# Altium schematic sheet PWR_MNG_V1.0.SchDoc
size A3
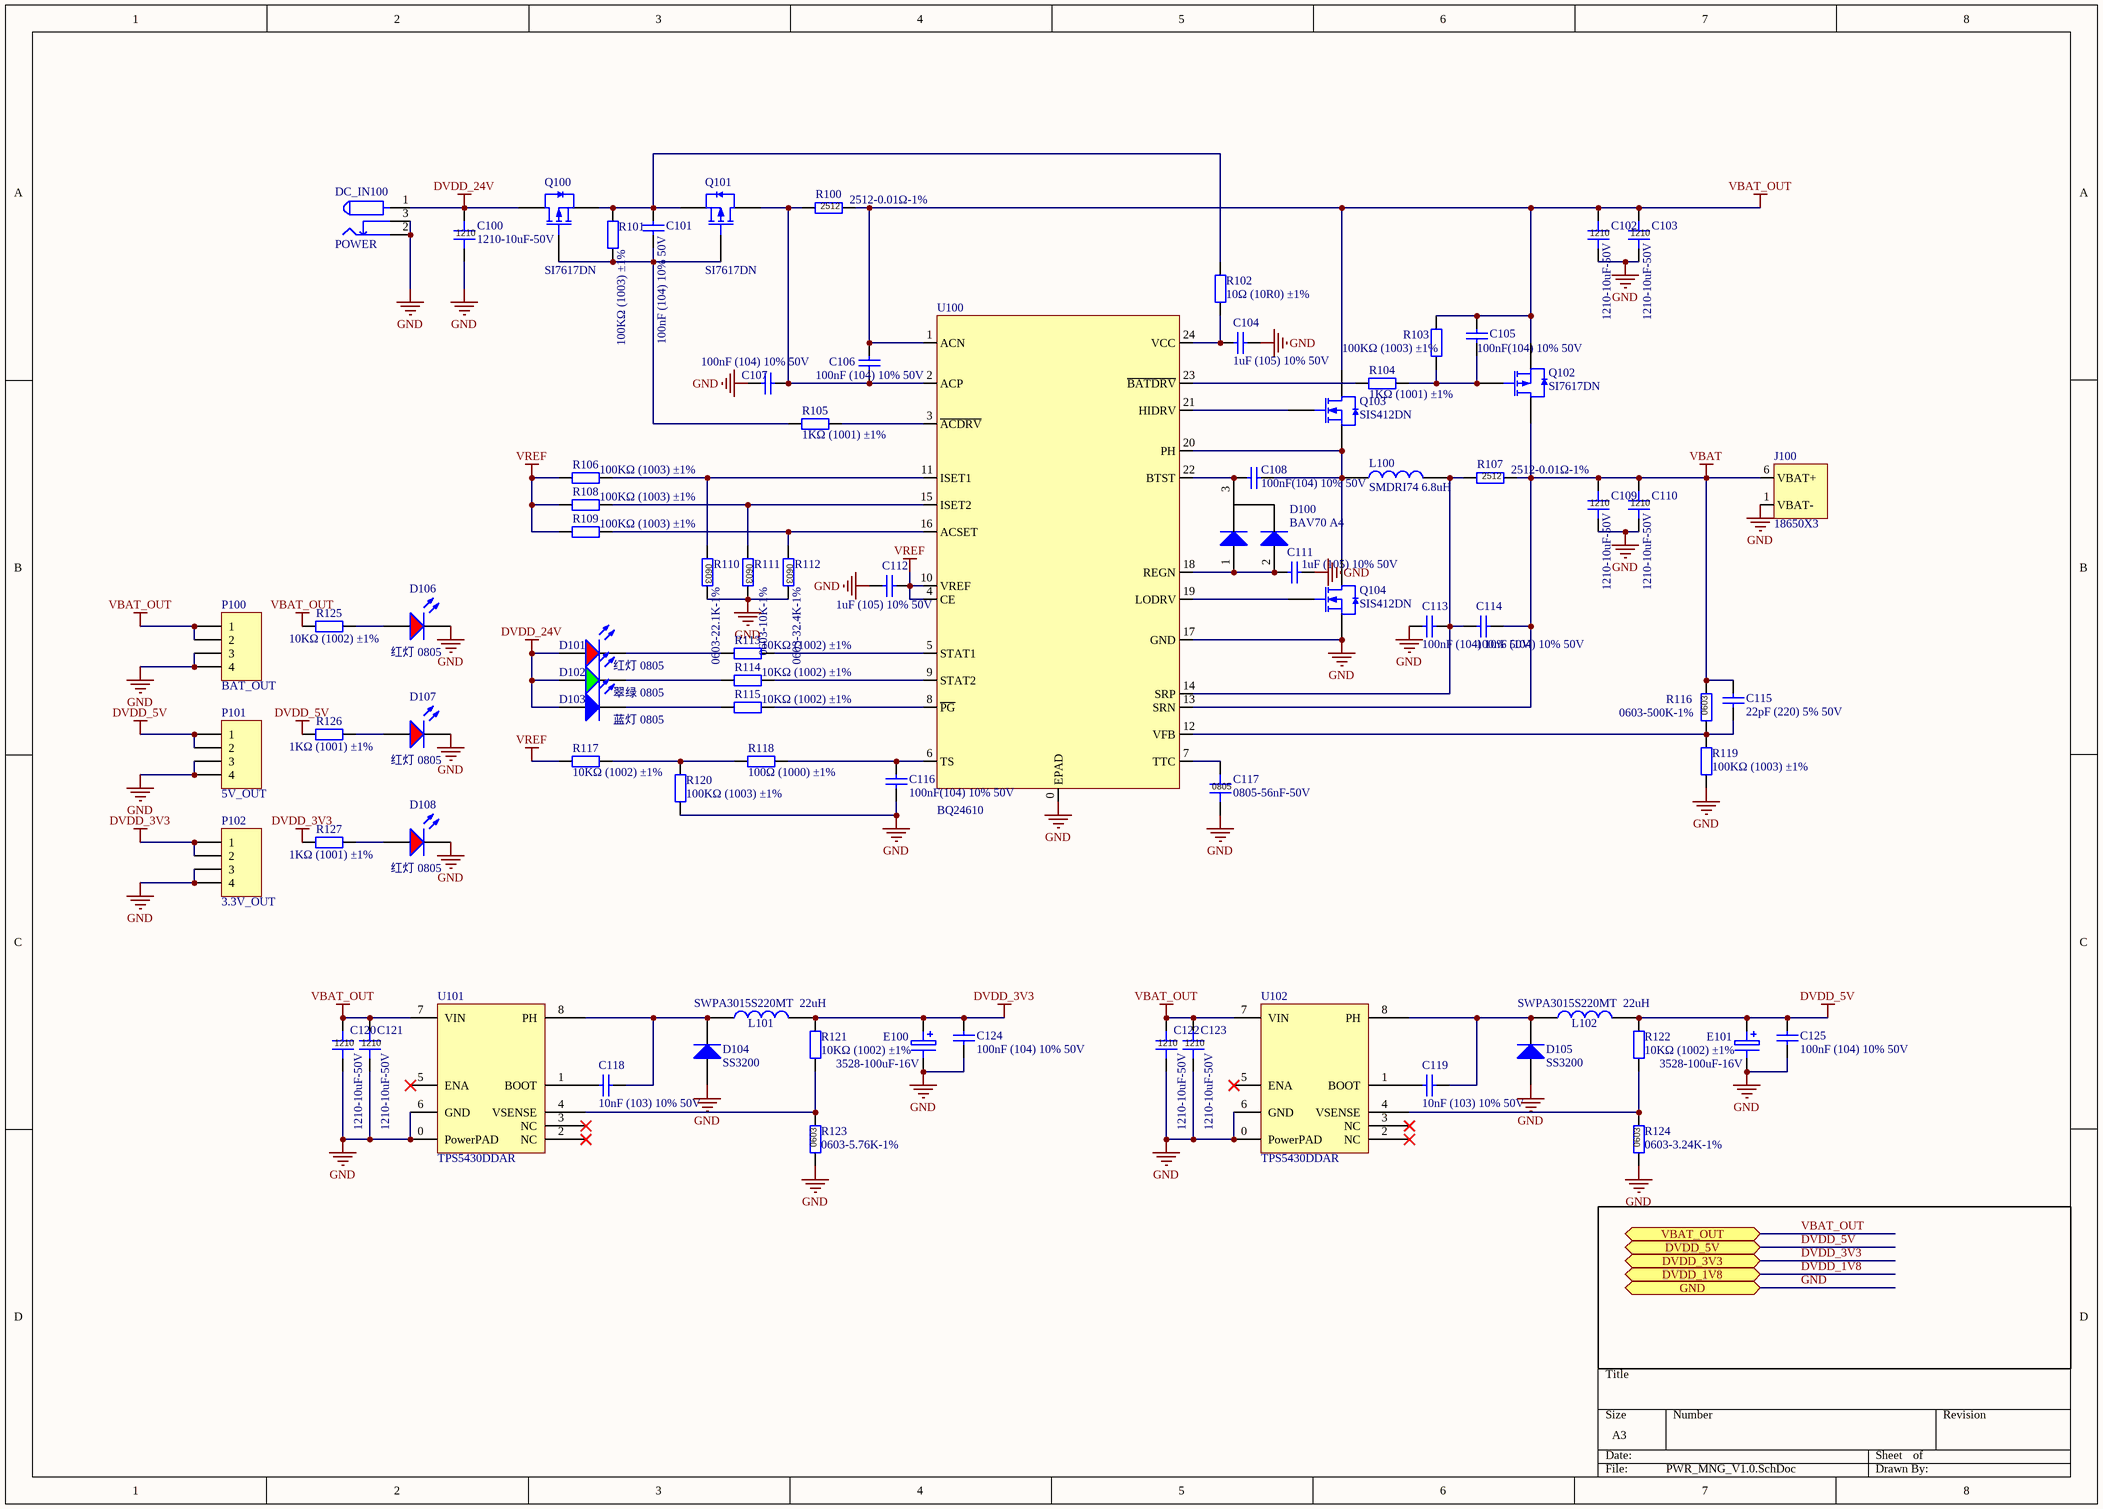
[diagram p0: PWR_MNG_V1.0.SchDoc]

## Parts
C100  1210-10uF-50V  [1210_C]
C101  100nF (104) 10% 50V  [0603_C]
C102  1210-10uF-50V  [1210_C]
C103  1210-10uF-50V  [1210_C]
C104  1uF (105) 10% 50V  [0805_C]
C105  100nF(104) 10% 50V  [0805_C]
C106  100nF (104) 10% 50V  [0603_C]
C107  100nF (104) 10% 50V  [0603_C]
C108  100nF(104) 10% 50V  [0805_C]
C109  1210-10uF-50V  [1210_C]
C110  1210-10uF-50V  [1210_C]
C111  1uF (105) 10% 50V  [0805_C]
C112  1uF (105) 10% 50V  [0805_C]
C113  100nF (104) 10% 50V  [0603_C]
C114  100nF (104) 10% 50V  [0603_C]
C115  22pF (220) 5% 50V  [0603_C]
C116  100nF(104) 10% 50V  [0805_C]
C117  0805-56nF-50V  [0805_C]
C118  10nF (103) 10% 50V  [0603_C]
C119  10nF (103) 10% 50V  [0603_C]
C120  1210-10uF-50V  [1210_C]
C121  1210-10uF-50V  [1210_C]
C122  1210-10uF-50V  [1210_C]
C123  1210-10uF-50V  [1210_C]
C124  100nF (104) 10% 50V  [0603_C]
C125  100nF (104) 10% 50V  [0603_C]
D100  BAV70 A4  [SOT-23(SOT-23-3)]
D101  红灯 0805  [0805_LED_S1]
D102  翠绿 0805  [0805_LED_S1]
D103  蓝灯 0805  [0805_LED_S1]
D104  SS3200  [SMA(DO-214AC)_S1]
D105  SS3200  [SMA(DO-214AC)_S1]
D106  红灯 0805  [0805_LED_S1]
D107  红灯 0805  [0805_LED_S1]
D108  红灯 0805  [0805_LED_S1]
DC_IN100  POWER  [DC002]
E100  3528-100uF-16V  [ES_3528]
E101  3528-100uF-16V  [ES_3528]
J100  18650X3  [18650X3]
L100  SMDRI74 6.8uH  [L 7.5*7.5*4.5]
L101  SWPA3015S220MT  22uH  [L 3.0*3.0*1.5]
L102  SWPA3015S220MT  22uH  [L 3.0*3.0*1.5]
P100  BAT_OUT  [HDR1X4]
P101  5V_OUT  [HDR1X4]
P102  3.3V_OUT  [HDR1X4]
Q100  SI7617DN  [PAK-1212-8]
Q101  SI7617DN  [PAK-1212-8]
Q102  SI7617DN  [PAK-1212-8]
Q103  SIS412DN  [PAK-1212-8]
Q104  SIS412DN  [PAK-1212-8]
R100  2512-0.01Ω-1%  [2512_R]
R101  100KΩ (1003) ±1%  [0603_R]
R102  10Ω (10R0) ±1%  [0805_R]
R103  100KΩ (1003) ±1%  [0805_R]
R104  1KΩ (1001) ±1%  [0805_R]
R105  1KΩ (1001) ±1%  [0603_R]
R106  100KΩ (1003) ±1%  [0603_R]
R107  2512-0.01Ω-1%  [2512_R]
R108  100KΩ (1003) ±1%  [0603_R]
R109  100KΩ (1003) ±1%  [0603_R]
R110  0603-22.1K-1%  [0603_R]
R111  0603-10K-1%  [0603_R]
R112  0603-32.4K-1%  [0603_R]
R113  10KΩ (1002) ±1%  [0805_R]
R114  10KΩ (1002) ±1%  [0805_R]
R115  10KΩ (1002) ±1%  [0805_R]
R116  0603-500K-1%  [0603_R]
R117  10KΩ (1002) ±1%  [0805_R]
R118  100Ω (1000) ±1%  [0805_R]
R119  100KΩ (1003) ±1%  [0603_R]
R120  100KΩ (1003) ±1%  [0805_R]
R121  10KΩ (1002) ±1%  [0603_R]
R122  10KΩ (1002) ±1%  [0603_R]
R123  0603-5.76K-1%  [0603_R]
R124  0603-3.24K-1%  [0603_R]
R125  10KΩ (1002) ±1%  [0805_R]
R126  1KΩ (1001) ±1%  [0805_R]
R127  1KΩ (1001) ±1%  [0805_R]
U100  BQ24610  [QFN-24_4x4x05P]
U101  TPS5430DDAR  [SOP-8_150mil DCDC]
U102  TPS5430DDAR  [SOP-8_150mil DCDC]

## Ports
DVDD_1V8, DVDD_3V3, DVDD_5V, GND, VBAT_OUT

## Nets
DVDD_3V3: C124.2 E100.1 L101.2 P102.1 P102.2 R121.2 R127.1 ; port DVDD_3V3
DVDD_5V: C125.2 E101.1 L102.2 P101.1 P101.2 R122.2 R126.1 ; port DVDD_5V
DVDD_24V: C100.1 D101.A D102.A D103.A DC_IN100.1 Q100.3(D)
GND: C100.2 C102.2 C103.2 C104.2 C107.1 C109.2 C110.2 C111.1 C112.1 C113.1 C116.1 C117.2 C120.2 C121.2 C122.2 C123.2 C124.1 C125.1 D104.1(A) D105.1(A) D106.K D107.K D108.K DC_IN100.2 DC_IN100.3 E100.2(E) E101.2(E) J100.1(VBAT-) P100.3 P100.4 P101.3 P101.4 P102.3 P102.4 Q104.2(S) R110.2 R111.2 R112.2 R119.1 R120.1 R123.1 R124.1 U100.0(EPAD) U100.17(GND) U101.0(PowerPAD) U101.6(GND) U102.0(PowerPAD) U102.6(GND) ; port GND
VBAT: C109.1 C110.1 C114.2 C115.2 J100.6(VBAT+) Q102.3(D) R107.2 R116.2 U100.13(SRN)
VBAT_OUT: C102.1 C103.1 C105.2 C106.2 C120.1 C121.1 C122.1 C123.1 P100.1 P100.2 Q102.2(S) Q103.3(D) R100.2 R103.2 R125.1 U100.1(ACN) U101.7(VIN) U102.7(VIN) ; port VBAT_OUT
VREF: C112.2 R106.1 R108.1 R109.1 R117.1 U100.4(CE) U100.10(VREF)
DVDD_1V8: port DVDD_1V8
NetC101_1: C101.1 Q100.1(G) Q101.1(G) R101.1 R105.2
NetC101_2: C101.2 Q100.2(S) Q101.2(S) R101.2 R102.2
NetC104_1: C104.1 R102.1 U100.24(VCC)
NetC105_1: C105.1 Q102.1(G) R103.1 R104.2
NetC106_1: C106.1 C107.2 Q101.3(D) R100.1 U100.2(ACP)
NetC108_1: C108.1 D100.3(K) U100.22(BTST)
NetC108_2: C108.2 L100.1 Q103.2(S) Q104.3(D) U100.20(PH)
NetC111_2: C111.2 D100.1(A) D100.2(A) U100.18(REGN)
NetC113_2: C113.2 C114.1 L100.2 R107.1 U100.14(SRP)
NetC115_1: C115.1 R116.1 R119.2 U100.12(VFB)
NetC116_2: C116.2 R118.2 U100.6(TS)
NetC117_1: C117.1 U100.7(TTC)
NetC118_1: C118.1 U101.1(BOOT)
NetC118_2: C118.2 D104.2(K) L101.1 U101.8(PH)
NetC119_1: C119.1 U102.1(BOOT)
NetC119_2: C119.2 D105.2(K) L102.1 U102.8(PH)
NetD101_K: D101.K R113.1
NetD102_K: D102.K R114.1
NetD103_K: D103.K R115.1
NetD106_A: D106.A R125.2
NetD107_A: D107.A R126.2
NetD108_A: D108.A R127.2
NetQ103_1: Q103.1(G) U100.21(HIDRV)
NetQ104_1: Q104.1(G) U100.19(LODRV)
NetR104_1: R104.1 U100.23(~{BATDRV})
NetR105_1: R105.1 U100.3(~{ACDRV})
NetR106_2: R106.2 R110.1 U100.11(ISET1)
NetR108_2: R108.2 R111.1 U100.15(ISET2)
NetR109_2: R109.2 R112.1 U100.16(ACSET)
NetR113_2: R113.2 U100.5(STAT1)
NetR114_2: R114.2 U100.9(STAT2)
NetR115_2: R115.2 U100.8(~{PG})
NetR117_2: R117.2 R118.1 R120.2
NetR121_1: R121.1 R123.2 U101.4(VSENSE)
NetR122_1: R122.1 R124.2 U102.4(VSENSE)

Not connected (* = marked no-connect by the designer): U101 2(NC)* 3(NC)* 5(ENA)*; U102 2(NC)* 3(NC)* 5(ENA)*

## Notes on the sheet
- (in symbol 0603 10KΩ (103) 1%) 0603
- (in symbol 0805 100nF (104) 10% 50V) 0805
- (in symbol 1210 10uF (106) 10% 50V) 1210
- (in symbol 2512 10KΩ (103) 1%) 2512

## Library data of the parts
C100 C102 C103 C109 C110 C120-C123 = 1210 10uF (106) 10% 50V: 贴片电容
C101 C106 C107 C113 C114 C124 C125 = 0603 100nF (104) 10% 50V: 贴片电容; ComponentLink1Description: 供应商链接; ComponentLink1URL: http://www.szlcsc.com/product/details_15331.html; Package: 0603; Supplier: LC; SuppliersPartNumber: C14663
C104 C111 C112 = 0805 1uF (105) 10% 50V: 贴片电容; ComponentLink1Description: 供应商链接; ComponentLink1URL: http://www.szlcsc.com/product/details_29074.html; Package: 0805; Supplier: LC; SuppliersPartNumber: C28323
C105 C108 C116 = 0805 100nF(104) 10% 50V: 贴片电容; ComponentLink1Description: 供应商链接; ComponentLink1URL: http://www.szlcsc.com/product/details_50686.html; Package: 0805; Supplier: LC; SuppliersPartNumber: C49678
C115 = 0603 22pF (220) 5% 50V: 贴片电容; ComponentLink1Description: 供应商链接; ComponentLink1URL: http://www.szlcsc.com/product/details_2005.html; Package: 0603; Supplier: LC; SuppliersPartNumber: C1653
C117 = 0805 100nF (104) 10% 50V: 贴片电容
C118 C119 = 0603 10nF (103) 10% 50V: 贴片电容; ComponentLink1Description: 供应商链接; ComponentLink1URL: http://www.szlcsc.com/product/details_58143.html; Package: 0603; Supplier: LC; SuppliersPartNumber: C57112
D100 = SOT-23 BAV70 A4: 开关二极管; ComponentLink1Description: 供应商链接; ComponentLink1URL: http://www.szlcsc.com/product/details_70091.html; Package: SOT-23; Supplier: LC; SuppliersPartNumber: C68978
D101 D106-D108 = 0805 红灯: 发光二极管; ComponentLink1Description: 供应商链接; ComponentLink1URL: http://www.szlcsc.com/product/details_2668.html; Package: 0805; Supplier: LC; SuppliersPartNumber: C2295
D102 = 0805 翠绿: 发光二极管; ComponentLink1Description: 供应商链接; ComponentLink1URL: http://www.szlcsc.com/product/details_2670.html; Package: 0805; Supplier: LC; SuppliersPartNumber: C2297
D103 = 0805 蓝灯: 发光二极管; ComponentLink1Description: 供应商链接; ComponentLink1URL: http://www.szlcsc.com/product/details_2666.html; Package: 0805; Supplier: LC; SuppliersPartNumber: C2293
D104 D105 = SMA(DO-214AC) M7: 二极管
DC_IN100 = PWR
E100 E101 = ES-3528: 贴片钽电容
J100 = 18650X3: BAT_BASE
L100-L102 = 10uH 20%: 贴片电感
P100-P102 = Header 4: Header, 4-Pin; LatestRevisionDate: 17-Jul-2002; LatestRevisionNote: Re-released for DXP Platform.; Publisher: Altium Limited
Q100-Q102 = SI7617DN: P-MOS
Q103 Q104 = SIS412DN: N-MOS
R100 R107 = 2512 10KΩ (103) 1%: 贴片电阻
R101 R106 R108 R109 R119 = 0603 100KΩ (1003) 1%: 贴片电阻; ComponentLink1Description: 供应商链接; ComponentLink1URL: http://www.szlcsc.com/product/details_26546.html; Package: 0603; Supplier: LC; SuppliersPartNumber: C25803
R102 = 0805 10Ω (10R0) 1%: 贴片电阻; ComponentLink1Description: 供应商链接; ComponentLink1URL: http://www.szlcsc.com/product/details_18103.html; Package: 0805; Supplier: LC; SuppliersPartNumber: C17415
R103 R120 = 0805 100KΩ (1003) 1%: 贴片电阻; ComponentLink1Description: 供应商链接; ComponentLink1URL: http://www.szlcsc.com/product/details_18095.html; Package: 0805; Supplier: LC; SuppliersPartNumber: C17407
R104 R126 R127 = 0805 1KΩ (1001) 1%: 贴片电阻; ComponentLink1Description: 供应商链接; ComponentLink1URL: http://www.szlcsc.com/product/details_18201.html; Package: 0805; Supplier: LC; SuppliersPartNumber: C17513
R105 = 0603 1KΩ (1001) 1%: 贴片电阻; ComponentLink1Description: 供应商链接; ComponentLink1URL: http://www.szlcsc.com/product/details_21904.html; Package: 0603; Supplier: LC; SuppliersPartNumber: C21190
R110-R112 R116 R123 R124 = 0603 10KΩ (103) 1%: 贴片电阻
R113-R115 R117 R125 = 0805 10KΩ (1002) 1%: 贴片电阻; ComponentLink1Description: 供应商链接; ComponentLink1URL: http://www.szlcsc.com/product/details_18102.html; Package: 0805; Supplier: LC; SuppliersPartNumber: C17414
R118 = 0805 100Ω (1000) 1%: 贴片电阻; ComponentLink1Description: 供应商链接; ComponentLink1URL: http://www.szlcsc.com/product/details_18096.html; Package: 0805; Supplier: LC; SuppliersPartNumber: C17408
R121 R122 = 0603 10KΩ (1002) 1%: 贴片电阻; ComponentLink1Description: 供应商链接; ComponentLink1URL: http://www.szlcsc.com/product/details_26547.html; Package: 0603; Supplier: LC; SuppliersPartNumber: C25804
U100 = BQ24610: Charg IC
U101 U102 = TPS5430DDAR: DC-DC芯片; Notepad: 0 pin:        GND pin must be connected to the exposed pad for proper operation.; Package: SOP-8_EP_150mil